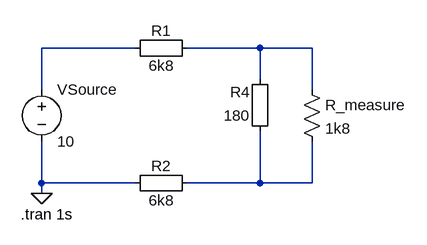
[diagram p0: schematic thevenin.asc]
thevenin.asc, the LTspice schematic file:
Version 4
SHEET 1 880 680
WIRE 16 32 -128 32
WIRE 208 32 96 32
WIRE 288 32 208 32
WIRE 208 80 208 32
WIRE -128 96 -128 32
WIRE 288 96 288 32
WIRE -128 240 -128 176
WIRE 16 240 -128 240
WIRE 208 240 208 160
WIRE 208 240 96 240
WIRE 288 240 288 176
WIRE 288 240 208 240
WIRE -128 256 -128 240
FLAG -128 256 0
SYMBOL voltage -128 80 R0
WINDOW 123 0 0 Left 0
WINDOW 39 0 0 Left 0
SYMATTR InstName VSource
SYMATTR Value 10
SYMBOL Misc\\EuropeanResistor 112 16 R90
WINDOW 0 5 56 VBottom 0
WINDOW 3 27 56 VTop 0
SYMATTR InstName R1
SYMATTR Value 6k8
SYMBOL Misc\\EuropeanResistor 112 224 R90
WINDOW 0 5 56 VBottom 0
WINDOW 3 27 56 VTop 0
SYMATTR InstName R2
SYMATTR Value 6k8
SYMBOL res 272 80 R0
SYMATTR InstName R_measure
SYMATTR Value 1k8
SYMBOL Misc\\EuropeanResistor 224 176 R180
WINDOW 0 31 76 Left 0
WINDOW 3 31 40 Left 0
SYMATTR InstName R4
SYMATTR Value 180
TEXT -160 288 Left 0 !.tran 1s

The netlist it stands for:
* thevenin.asc
VSource N001 0 10
R1 N002 N001 6k8
R2 N003 0 6k8
R_measure N002 N003 1k8
R4 N003 N002 180
.tran 1s
.backanno
.end